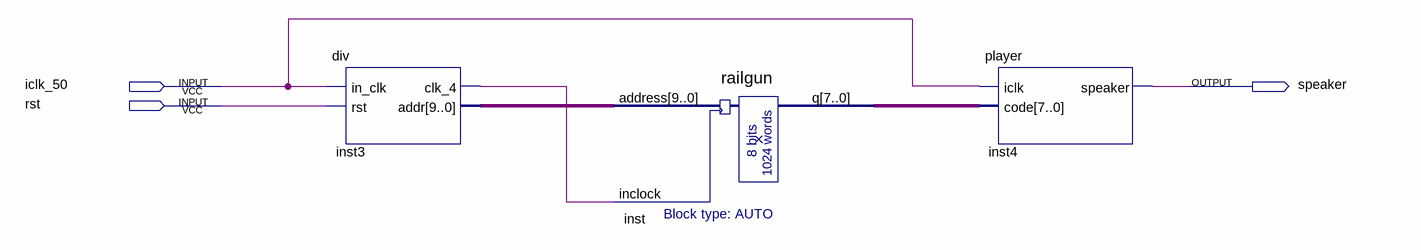
[diagram p0: schematic sheet]
// Quartus schematic music.bdf as structural Verilog: 3 symbols, 3 pins
module music (
  input  iclk_50,
  input  rst,
  output speaker
);

  wire inst3_clk_4;
  wire [7:0] inst_q;
  wire [9:0] inst3_addr;

  div inst3 (.in_clk(iclk_50), .rst(rst), .clk_4(inst3_clk_4), .addr(inst3_addr));
  railgun inst (.address(inst3_addr), .inclock(inst3_clk_4), .q(inst_q));
  player inst4 (.iclk(iclk_50), .code(inst_q), .speaker(speaker));
endmodule
